# Altium schematic sheet servo.SchDoc: SERVOCONTROLLER module
size A3; DocumentNumber: UCNC.03.00.001
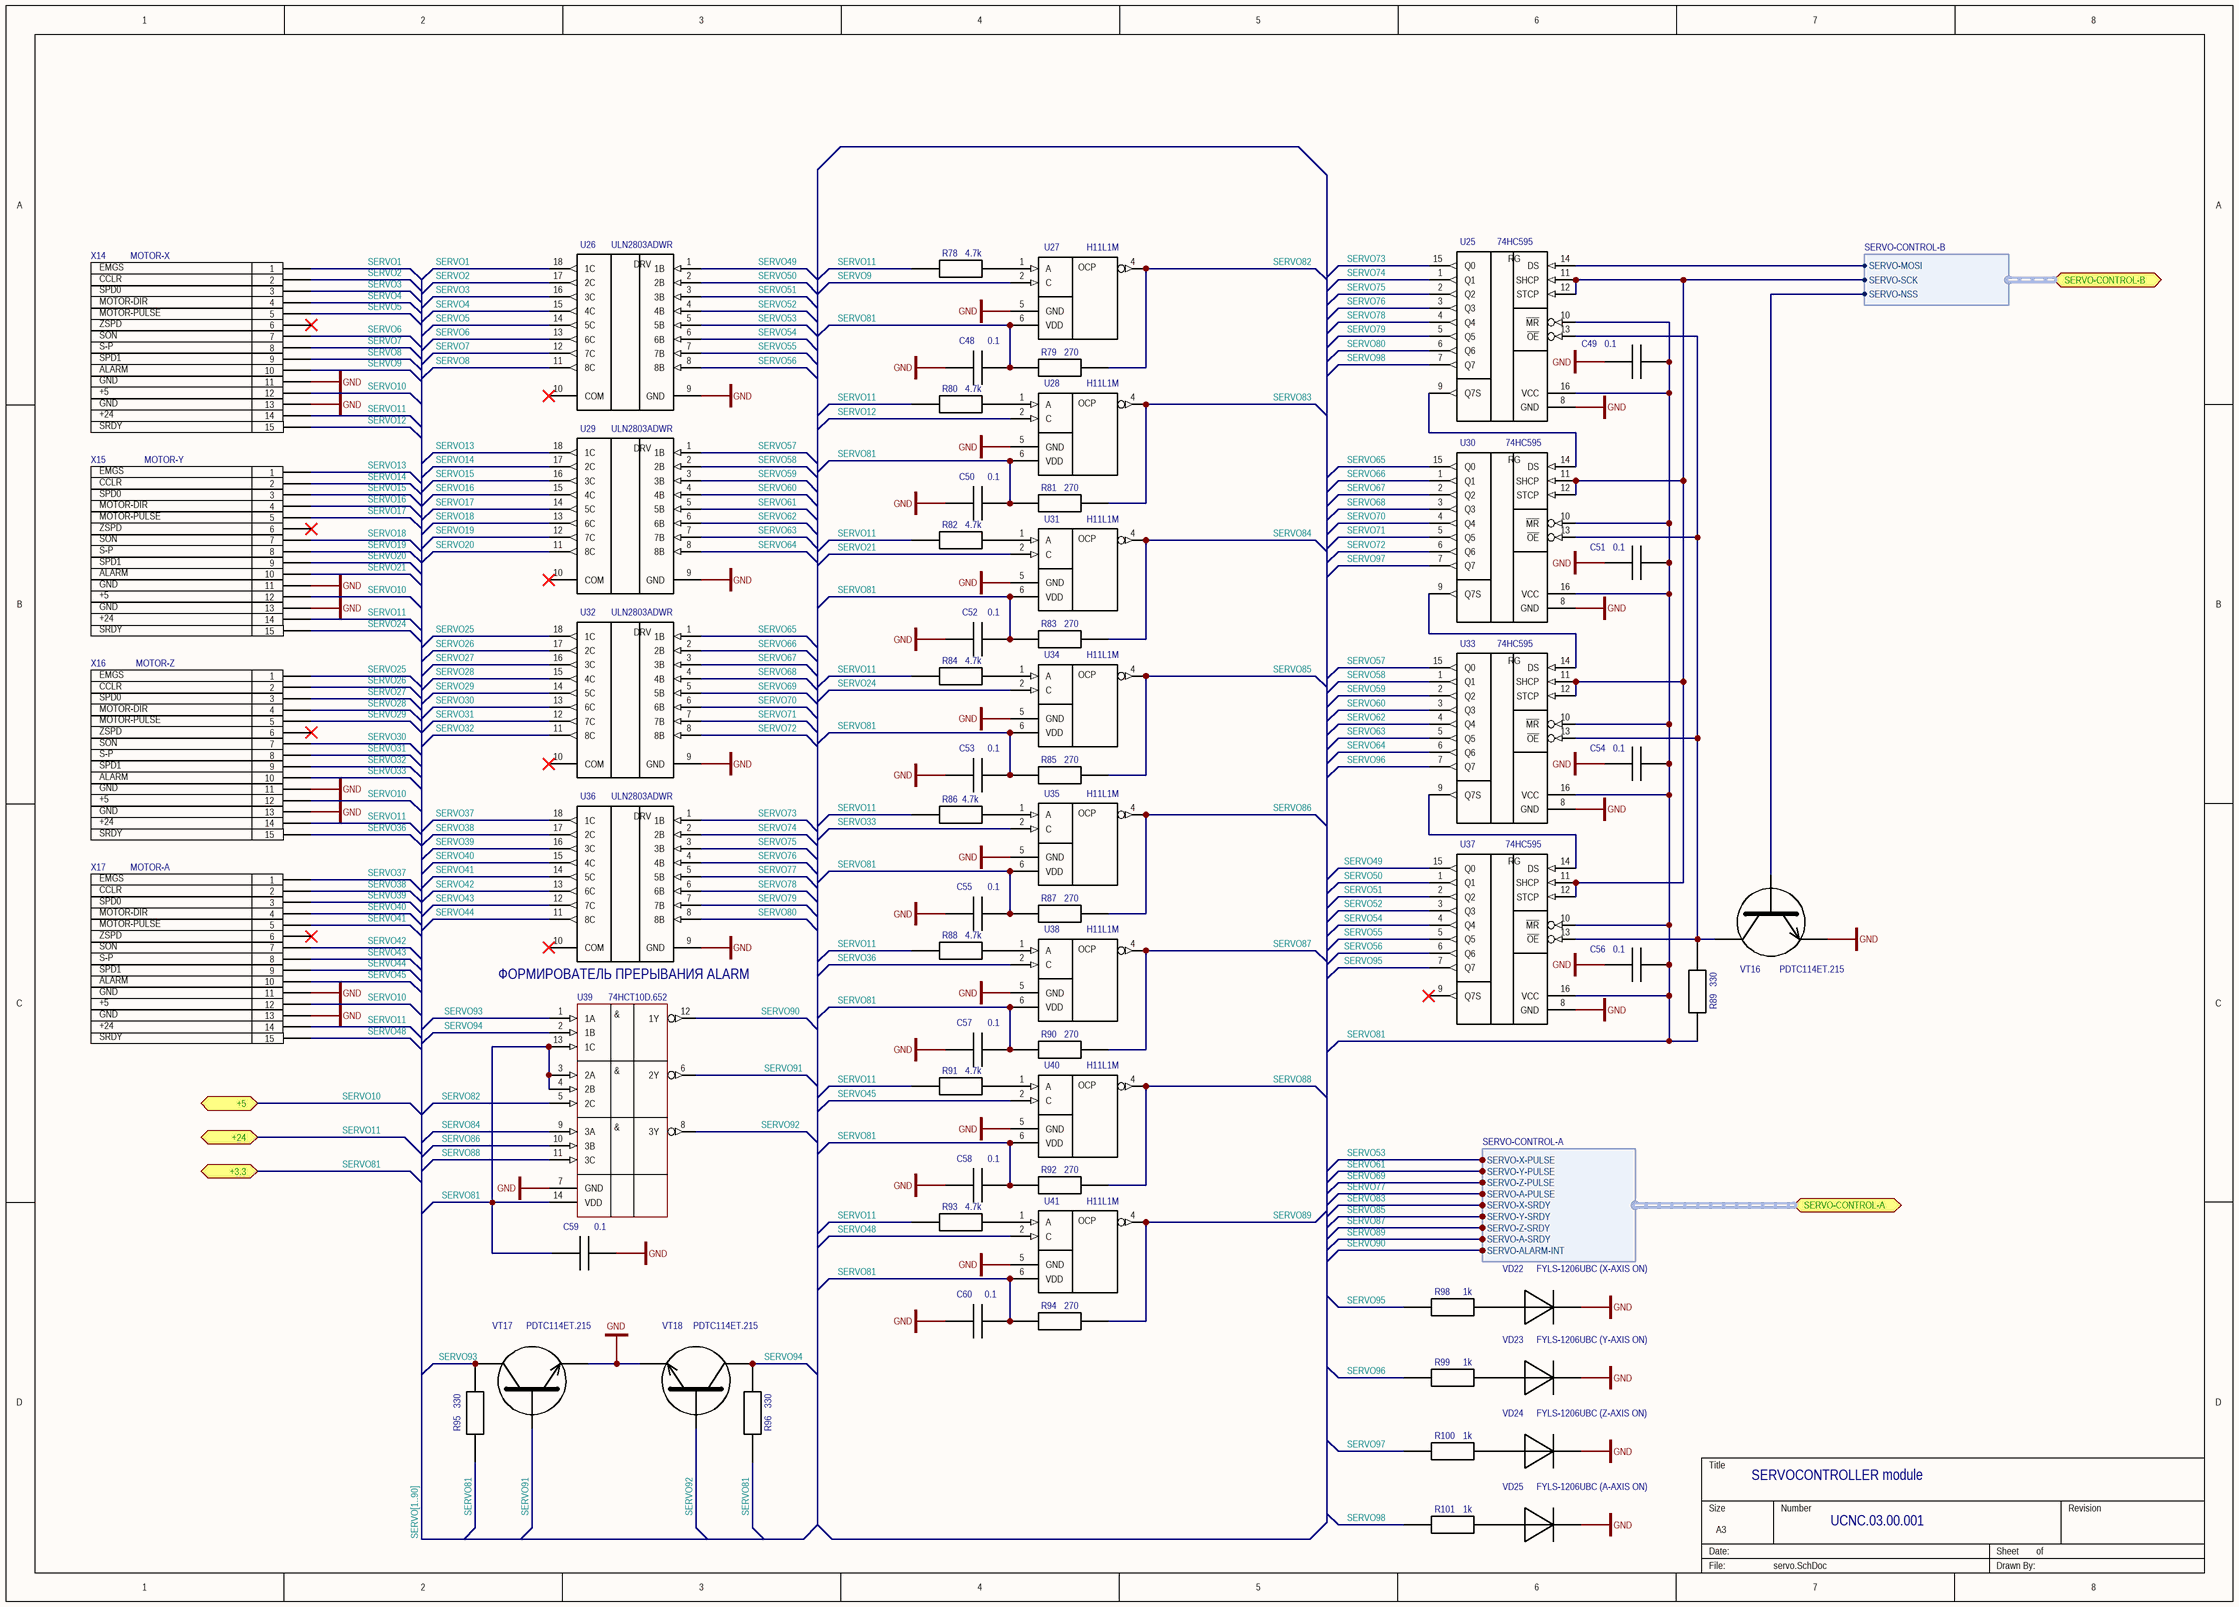
[diagram p0: servo.SchDoc]

## Parts
C48  0.1  [CAPC2012X04N]
C49  0.1  [CAPC2012X04N]
C50  0.1  [CAPC2012X04N]
C51  0.1  [CAPC2012X04N]
C52  0.1  [CAPC2012X04N]
C53  0.1  [CAPC2012X04N]
C54  0.1  [CAPC2012X04N]
C55  0.1  [CAPC2012X04N]
C56  0.1  [CAPC2012X04N]
C57  0.1  [CAPC2012X04N]
C58  0.1  [CAPC2012X04N]
C59  0.1  [CAPC2012X04N]
C60  0.1  [CAPC2012X04N]
R78  4.7k  [RESC2012X04N]
R79  270  [RESC2012X04N]
R80  4.7k  [RESC2012X04N]
R81  270  [RESC2012X04N]
R82  4.7k  [RESC2012X04N]
R83  270  [RESC2012X04N]
R84  4.7k  [RESC2012X04N]
R85  270  [RESC2012X04N]
R86  4.7k  [RESC2012X04N]
R87  270  [RESC2012X04N]
R88  4.7k  [RESC2012X04N]
R89  330  [RESC1608X05N]
R90  270  [RESC2012X04N]
R91  4.7k  [RESC2012X04N]
R92  270  [RESC2012X04N]
R93  4.7k  [RESC2012X04N]
R94  270  [RESC2012X04N]
R95  330  [RESC2012X04N]
R96  330  [RESC2012X04N]
R98  1k  [RESC2012X04N]
R99  1k  [RESC2012X04N]
R100  1k  [RESC2012X04N]
R101  1k  [RESC2012X04N]
U25  74HC595  [SOP127P700X210-16N]
U26  ULN2803ADWR  [SOIC127P1030X265-18N]
U27  H11L1M  [DIP6]
U28  H11L1M  [DIP6]
U29  ULN2803ADWR  [SOIC127P1030X265-18N]
U30  74HC595  [SOP127P700X210-16N]
U31  H11L1M  [DIP6]
U32  ULN2803ADWR  [SOIC127P1030X265-18N]
U33  74HC595  [SOP127P700X210-16N]
U34  H11L1M  [DIP6]
U35  H11L1M  [DIP6]
U36  ULN2803ADWR  [SOIC127P1030X265-18N]
U37  74HC595  [SOP127P700X210-16N]
U38  H11L1M  [DIP6]
U39  74HCT10D.652  [SOIC127P600X175-14N]
U40  H11L1M  [DIP6]
U41  H11L1M  [DIP6]
VD22  FYLS-1206UBC (X-AXIS ON)  [CAPMP3216X11N]
VD23  FYLS-1206UBC (Y-AXIS ON)  [CAPMP3216X11N]
VD24  FYLS-1206UBC (Z-AXIS ON)  [CAPMP3216X11N]
VD25  FYLS-1206UBC (A-AXIS ON)  [CAPMP3216X11N]
VT16  PDTC114ET.215  [SOT95P238X102-3N]
VT17  PDTC114ET.215  [SOT95P238X102-3N]
VT18  PDTC114ET.215  [SOT95P238X102-3N]
X14  MOTOR-X  [DMR15F-HD]
X15  MOTOR-Y  [DMR15F-HD]
X16  MOTOR-Z  [DMR15F-HD]
X17  MOTOR-A  [DMR15F-HD]

## Ports
+3.3, +5, +24, SERVO-CONTROL-A (harness SERVO-CONTROL-A), SERVO-CONTROL-B (harness SERVO-CONTROL-B)

## Harnesses
SERVO-CONTROL-A: SERVO-X-PULSE, SERVO-Y-PULSE, SERVO-Z-PULSE, SERVO-A-PULSE, SERVO-X-SRDY, SERVO-Y-SRDY, SERVO-Z-SRDY, SERVO-A-SRDY, SERVO-ALARM-INT
SERVO-CONTROL-B: SERVO-MOSI, SERVO-SCK, SERVO-NSS

## Nets
GND: C48.1 C49.2 C50.1 C51.2 C52.1 C53.1 C54.2 C55.1 C56.2 C57.1 C58.1 C59.2 C60.1 U25.8(GND) U26.9(GND) U27.5(GND) U28.5(GND) U29.9(GND) U30.8(GND) U31.5(GND) U32.9(GND) U33.8(GND) U34.5(GND) U35.5(GND) U36.9(GND) U37.8(GND) U38.5(GND) U39.7(GND) U40.5(GND) U41.5(GND) VD22.1(C) VD23.1(C) VD24.1(C) VD25.1(C) VT16.2(E) VT17.2(E) VT18.2(E) X14.11 X14.13 X15.11 X15.13 X16.11 X16.13 X17.11 X17.13
SERVO1: U26.18(1C) X14.1
SERVO2: U26.17(2C) X14.2
SERVO3: U26.16(3C) X14.3
SERVO4: U26.15(4C) X14.4
SERVO5: U26.14(5C) X14.5
SERVO6: U26.13(6C) X14.7
SERVO7: U26.12(7C) X14.8
SERVO8: U26.11(8C) X14.9
SERVO9: U27.2(C) X14.10
SERVO10: X14.12 X15.12 X16.12 X17.12 ; port +5
SERVO11: R78.1 R80.1 R82.1 R84.1 R86.1 R88.1 R91.1 R93.1 X14.14 X15.14 X16.14 X17.14 ; port +24
SERVO12: U28.2(C) X14.15
SERVO13: U29.18(1C) X15.1
SERVO14: U29.17(2C) X15.2
SERVO15: U29.16(3C) X15.3
SERVO16: U29.15(4C) X15.4
SERVO17: U29.14(5C) X15.5
SERVO18: U29.13(6C) X15.7
SERVO19: U29.12(7C) X15.8
SERVO20: U29.11(8C) X15.9
SERVO21: U31.2(C) X15.10
SERVO24: U34.2(C) X15.15
SERVO25: U32.18(1C) X16.1
SERVO26: U32.17(2C) X16.2
SERVO27: U32.16(3C) X16.3
SERVO28: U32.15(4C) X16.4
SERVO29: U32.14(5C) X16.5
SERVO30: U32.13(6C) X16.7
SERVO31: U32.12(7C) X16.8
SERVO32: U32.11(8C) X16.9
SERVO33: U35.2(C) X16.10
SERVO36: U38.2(C) X16.15
SERVO37: U36.18(1C) X17.1
SERVO38: U36.17(2C) X17.2
SERVO39: U36.16(3C) X17.3
SERVO40: U36.15(4C) X17.4
SERVO41: U36.14(5C) X17.5
SERVO42: U36.13(6C) X17.7
SERVO43: U36.12(7C) X17.8
SERVO44: U36.11(8C) X17.9
SERVO45: U40.2(C) X17.10
SERVO48: U41.2(C) X17.15
SERVO49: U26.1(1B) U37.15(Q0)
SERVO50: U26.2(2B) U37.1(Q1)
SERVO51: U26.3(3B) U37.2(Q2)
SERVO52: U26.4(4B) U37.3(Q3)
SERVO53: U26.5(5B) ; port SERVO-CONTROL-A.SERVO-X-PULSE
SERVO54: U26.6(6B) U37.4(Q4)
SERVO55: U26.7(7B) U37.5(Q5)
SERVO56: U26.8(8B) U37.6(Q6)
SERVO57: U29.1(1B) U33.15(Q0)
SERVO58: U29.2(2B) U33.1(Q1)
SERVO59: U29.3(3B) U33.2(Q2)
SERVO60: U29.4(4B) U33.3(Q3)
SERVO61: U29.5(5B) ; port SERVO-CONTROL-A.SERVO-Y-PULSE
SERVO62: U29.6(6B) U33.4(Q4)
SERVO63: U29.7(7B) U33.5(Q5)
SERVO64: U29.8(8B) U33.6(Q6)
SERVO65: U30.15(Q0) U32.1(1B)
SERVO66: U30.1(Q1) U32.2(2B)
SERVO67: U30.2(Q2) U32.3(3B)
SERVO68: U30.3(Q3) U32.4(4B)
SERVO69: U32.5(5B) ; port SERVO-CONTROL-A.SERVO-Z-PULSE
SERVO70: U30.4(Q4) U32.6(6B)
SERVO71: U30.5(Q5) U32.7(7B)
SERVO72: U30.6(Q6) U32.8(8B)
SERVO73: U25.15(Q0) U36.1(1B)
SERVO74: U25.1(Q1) U36.2(2B)
SERVO75: U25.2(Q2) U36.3(3B)
SERVO76: U25.3(Q3) U36.4(4B)
SERVO77: U36.5(5B) ; port SERVO-CONTROL-A.SERVO-A-PULSE
SERVO78: U25.4(Q4) U36.6(6B)
SERVO79: U25.5(Q5) U36.7(7B)
SERVO80: U25.6(Q6) U36.8(8B)
SERVO81: C48.2 C49.1 C50.2 C51.1 C52.2 C53.2 C54.1 C55.2 C56.1 C57.2 C58.2 C59.1 C60.2 R79.1 R81.1 R83.1 R85.1 R87.1 R89.1 R90.1 R92.1 R94.1 R95.1 R96.1 U25.10(~{MR}) U25.16(VCC) U27.6(VDD) U28.6(VDD) U30.10(~{MR}) U30.16(VCC) U31.6(VDD) U33.10(~{MR}) U33.16(VCC) U34.6(VDD) U35.6(VDD) U37.10(~{MR}) U37.16(VCC) U38.6(VDD) U39.3(2A) U39.4(2B) U39.13(1C) U39.14(VDD) U40.6(VDD) U41.6(VDD) ; port +3.3
SERVO82: R79.2 U27.4(OUT) U39.5(2C)
SERVO83: R81.2 U28.4(OUT) ; port SERVO-CONTROL-A.SERVO-X-SRDY
SERVO84: R83.2 U31.4(OUT) U39.9(3A)
SERVO85: R85.2 U34.4(OUT) ; port SERVO-CONTROL-A.SERVO-Y-SRDY
SERVO86: R87.2 U35.4(OUT) U39.10(3B)
SERVO87: R90.2 U38.4(OUT) ; port SERVO-CONTROL-A.SERVO-Z-SRDY
SERVO88: R92.2 U39.11(3C) U40.4(OUT)
SERVO89: R94.2 U41.4(OUT) ; port SERVO-CONTROL-A.SERVO-A-SRDY
SERVO90: U39.12(1Y) ; port SERVO-CONTROL-A.SERVO-ALARM-INT
SERVO91: U39.6(2Y) VT17.1(B)
SERVO92: U39.8(3Y) VT18.1(B)
SERVO93: R95.2 U39.1(1A) VT17.3(C)
SERVO94: R96.2 U39.2(1B) VT18.3(C)
SERVO95: R98.2 U37.7(Q7)
SERVO96: R99.2 U33.7(Q7)
SERVO97: R100.2 U30.7(Q7)
SERVO98: R101.2 U25.7(Q7)
NetR78_2: R78.2 U27.1(A)
NetR80_2: R80.2 U28.1(A)
NetR82_2: R82.2 U31.1(A)
NetR84_2: R84.2 U34.1(A)
NetR86_2: R86.2 U35.1(A)
NetR88_2: R88.2 U38.1(A)
NetR89_2: R89.2 U25.13(~{OE}) U30.13(~{OE}) U33.13(~{OE}) U37.13(~{OE}) VT16.3(C)
NetR91_2: R91.2 U40.1(A)
NetR93_2: R93.2 U41.1(A)
NetR98_1: R98.1 VD22.2(A)
NetR99_1: R99.1 VD23.2(A)
NetR100_1: R100.1 VD24.2(A)
NetR101_1: R101.1 VD25.2(A)
NetU25_9: U25.9(Q7S) U30.14(DS)
NetU25_11: U25.11(SHCP) U25.12(STCP) U30.11(SHCP) U30.12(STCP) U33.11(SHCP) U33.12(STCP) U37.11(SHCP) U37.12(STCP) ; port SERVO-CONTROL-B.SERVO-SCK
NetU25_14: U25.14(DS) ; port SERVO-CONTROL-B.SERVO-MOSI
NetU30_9: U30.9(Q7S) U33.14(DS)
NetU33_9: U33.9(Q7S) U37.14(DS)
NetVT16_1: VT16.1(B) ; port SERVO-CONTROL-B.SERVO-NSS

Not connected (* = marked no-connect by the designer): U26 10(COM)*; U29 10(COM)*; U32 10(COM)*; U36 10(COM)*; U37 9(Q7S)*; X14 6*; X15 6*; X16 6*; X17 6*

## Buses and harness runs
bus SERVO[1..90]

## Notes on the sheet
- ZSPD
- EMGS
- SPD0
- CCLR
- SON
- MOTOR-DIR
- MOTOR-PULSE
- GND
- +5
- ALARM
- S-P
- SPD1
- +24
- SRDY
- (near U36) ФОРМИРОВАТЕЛЬ ПРЕРЫВАНИЯ ALARM
- (in symbol 74HC595) RG
- (in symbol 74HCT10D.652) &
- (in symbol H11L1M) OCP
- (in symbol ULN2803ADWR) DRV

## Library data of the parts
C48-C60 = C: SMD конденсатор; Ref: http://www.kosmodrom.com.ua/prodlist.php?name=cap1206
R78-R96 R98-R101 = R: SMD резистор; Ref: http://www.kosmodrom.com.ua/prodlist.php?name=res1206
U26 U29 U32 U36 = ULN2803ADWR: 8 Darlington transistors
U27 U28 U31 U34 U35 U38 U40 U41 = H11L1M: Fairchild H11L1M Schmitt Trigger Output Optocoupler; Ref: http://www.kosmodrom.com.ua/el.php?name=H11L1M
VD22-VD25 = FYLS-1206: Светодиод; Ref: http://www.kosmodrom.com.ua/prodlist.php?page=0&name=FYLS-1206&okbutton=%CF%EE%E8%F1%EA+%EF%EE+%F1%EA%EB%E0%E4%F3
VT16-VT18 = PDTC114ET.215: NPN transistor with bias circuit
X14-X17 = DMR15F-HD